# Altium schematic sheet Схема блока IO_Ports.SchDoc
size 420 x 297 mm; Address1: Address1; Address2: Address2; Address3: Address3; Address4: Address4; DocumentNumber: АБВГ.123456.001 Э3; SheetNumber: 1; Scale: 1:1; DocumentType: Схема электрическая принципиальная; FirstReferrence: АБВГ.123456.001
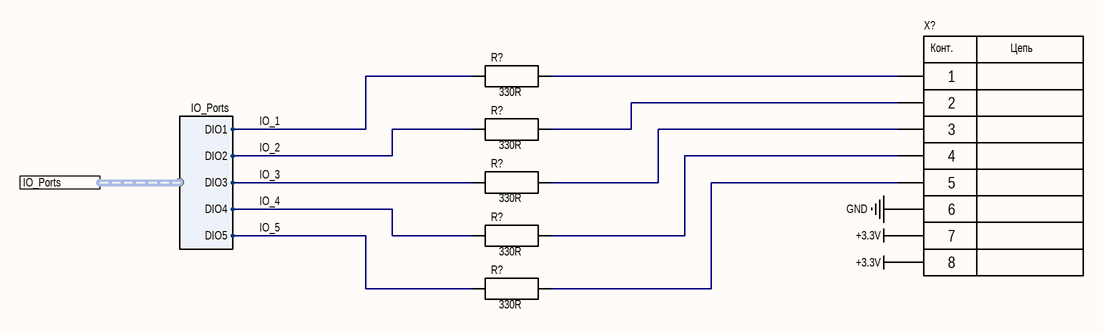
[diagram p0: Схема блока IO_Ports.SchDoc]

## Parts
(Parts that share a designator on the sheet are numbered #1, #2 ... from top to bottom, then left to right.)
R?#1  330R  [CH0603R]
R?#2  330R  [CH0603R]
R?#3  330R  [CH0603R]
R?#4  330R  [CH0603R]
R?#5  330R  [CH0603R]
X?  *  [CON: PLD-8]  (value not drawn)

## Ports
IO_Ports (harness IO_Ports)

## Harnesses
IO_Ports: DIO1, DIO2, DIO3, DIO4, DIO5

## Nets
+3.3V: X?.7 X?.8
GND: X?.6
IO_1: R?#1.1 ; port IO_Ports.DIO1
IO_2: R?#2.1 ; port IO_Ports.DIO2
IO_3: R?#3.1 ; port IO_Ports.DIO3
IO_4: R?#4.1 ; port IO_Ports.DIO4
IO_5: R?#5.1 ; port IO_Ports.DIO5
NetR?#1_2: R?#1.2 X?.1
NetR?#2_2: R?#2.2 X?.2
NetR?#3_2: R?#3.2 X?.3
NetR?#4_2: R?#4.2 X?.4
NetR?#5_2: R?#5.2 X?.5

## Notes on the sheet
- Подп. и дата
- Инв. № дубл.
- Взам. инв. №
- Инв. № подл.
- Изм.
- Лист
- № докум.
- Подп.
- Дата
- 2.106-A3
- Копировал
- Формат А3
- (in symbol 8-Connector) Конт.; Цепь

## Library data of the parts
R?#1-R?#5 = Resistor: Manufacturer: Panasonic Electronic Components; Model: ERJ-3EKF3300V; HelpURL: https://www.digikey.com/en/products/detail/panasonic-electronic-components/ERJ-3EKF3300V/1746374?s=N4IgTCBcDaIKICUBSBmOBpAYilAGXAaiALoC%2BQA; ComponentKind: 0603 (1608 Metric); Value: 330R
X? = 8-Connector: Model: *; Manufacturer: *; HelpURL: *; ComponentKind: *